# Altium schematic sheet MCU.SchDoc
size Legal; Author: Mark & Qiming; DocumentNumber: 3; SheetNumber: 3; SheetTotal: 9
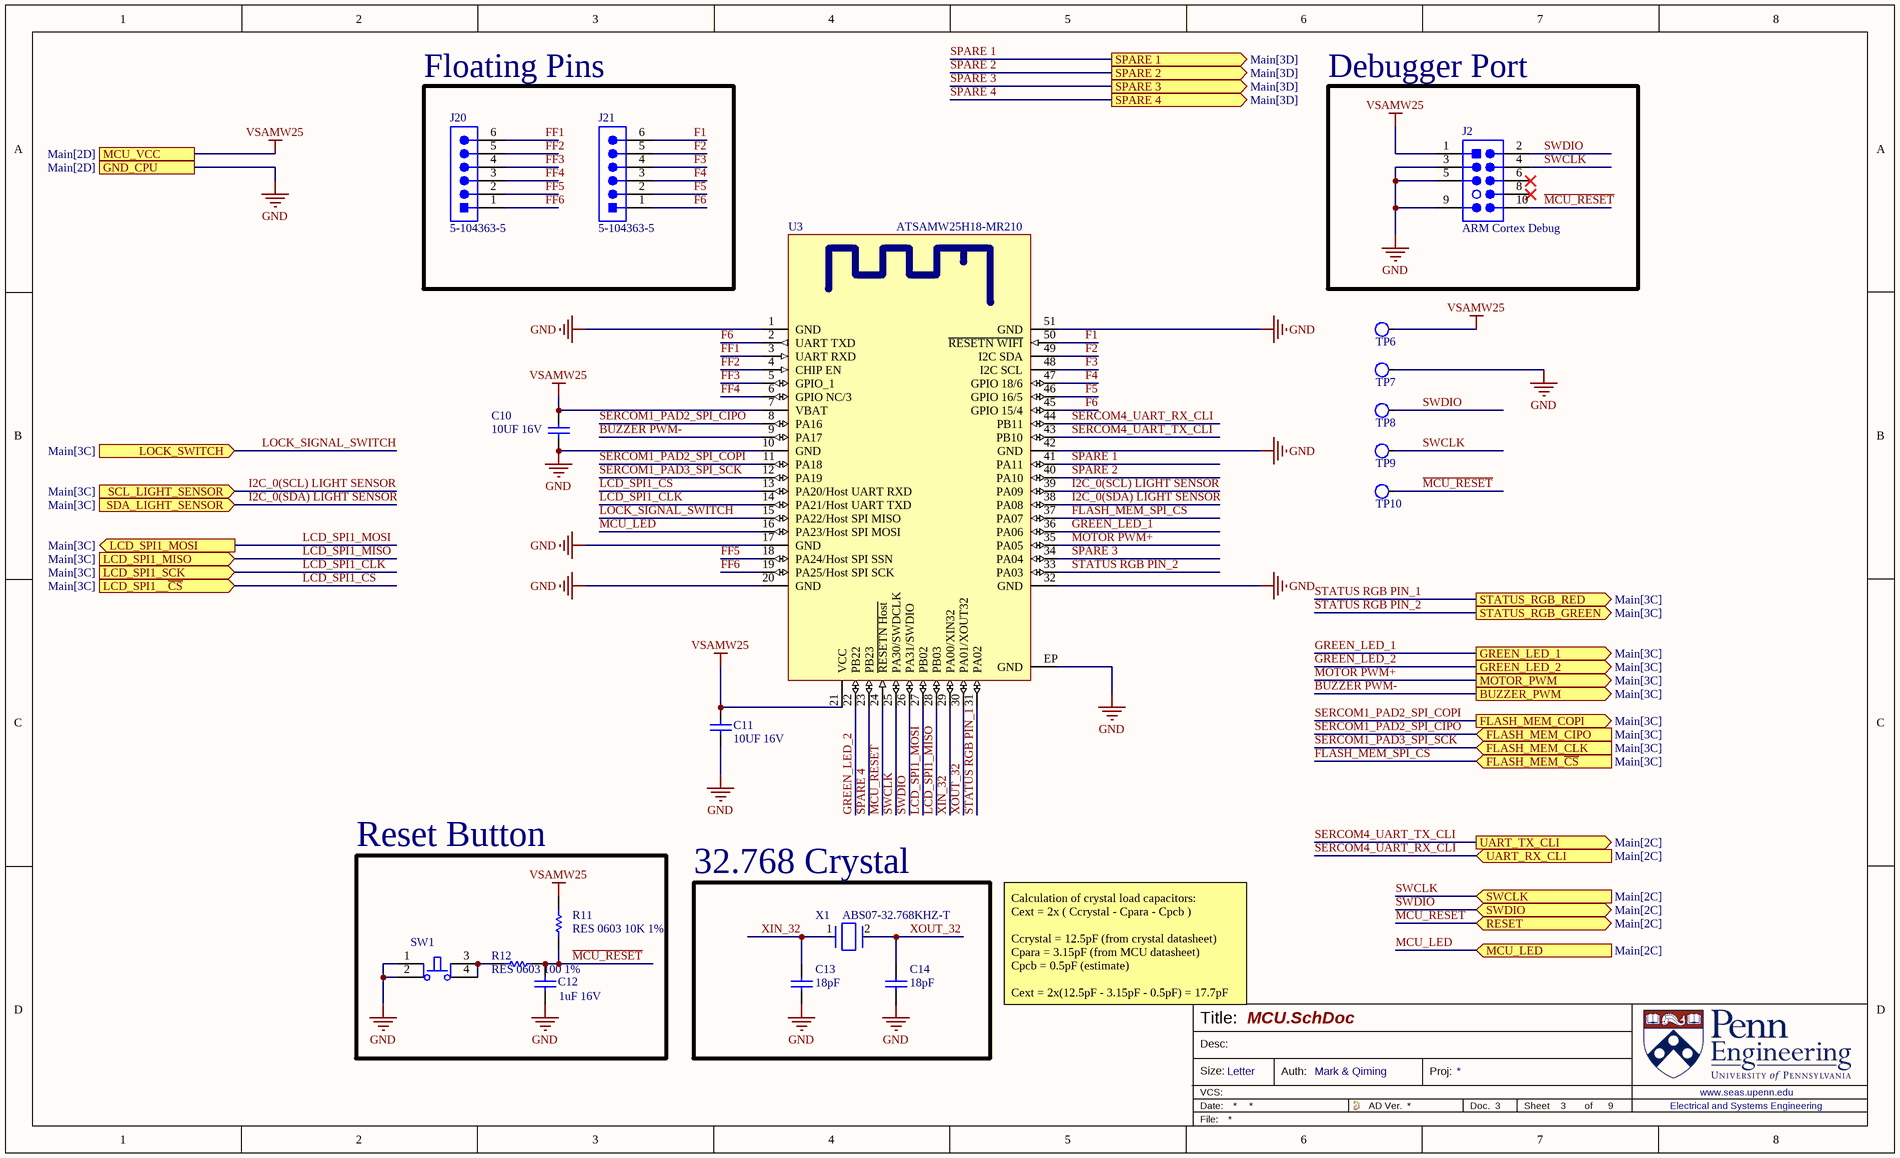
[diagram p0: MCU.SchDoc]

## Parts
C10  10UF 16V  [0805_CAP_60H]
C11  10UF 16V  [0805_CAP_60H]
C12  1uF 16V  [0603_CAP]
C13  18pF  [0603_CAP]
C14  18pF  [0603_CAP]
J2  ARM Cortex Debug  [FTSH-105-01-F-DV-007-K PLUGIN]
J20  5-104363-5  [5-104363-5-Footprint-1]
J21  5-104363-5  [5-104363-5-Footprint-1]
R11  RES 0603 10K 1%  [0603_RES]
R12  RES 0603 100 1%  [0603_RES]
SW1  PTS810SJK250SMTRLFS  [PTS810SJK250SMTRLFS-Footprint-1]  (value not drawn)
TP6  Testpad  [SMT Testpoint, 50mil]  (value not drawn)  (no BOM)
TP7  Testpad  [SMT Testpoint, 50mil]  (value not drawn)  (no BOM)
TP8  Testpad  [SMT Testpoint, 50mil]  (value not drawn)  (no BOM)
TP9  Testpad  [SMT Testpoint, 50mil]  (value not drawn)  (no BOM)
TP10  Testpad  [SMT Testpoint, 50mil]  (value not drawn)  (no BOM)
U3  ATSAMW25H18-MR210  [ATSAMW25H18-MR210-Footprint-1]
X1  ABS07-32.768KHZ-T  [FP-ABS07-MFG]

## Blocks framed on the sheet
Floating Pins: J20 J21
Debugger Port: J2
Reset Button: C12 R11 R12 SW1
32.768 Crystal: C13 C14 X1

## Ports
BUZZER_PWM (out, see Main[3C]), FLASH_MEM_CIPO (in, see Main[3C]), FLASH_MEM_CLK (in, see Main[3C]), FLASH_MEM_COPI (out, see Main[3C]), FLASH_MEM_~{CS} (in, see Main[3C]), GND_CPU (see Main[2D]), GREEN_LED_1 (out, see Main[3C]), GREEN_LED_2 (out, see Main[3C]), LCD_SPI1__~{CS} (in, see Main[3C]), LCD_SPI1_MISO (in, see Main[3C]), LCD_SPI1_MOSI (out, see Main[3C]), LCD_SPI1_SCK (in, see Main[3C]), LOCK_SWITCH (in, see Main[3C]), MCU_LED (in, see Main[2C]), MCU_VCC (see Main[2D]), MOTOR_PWM (out, see Main[3C]), RESET (bidir, see Main[2C]), SCL_LIGHT_SENSOR (in, see Main[3C]), SDA_LIGHT_SENSOR (in, see Main[3C]), SPARE 1 (out, see Main[3D]), SPARE 2 (out, see Main[3D]), SPARE 3 (out, see Main[3D]), SPARE 4 (out, see Main[3D]), STATUS_RGB_GREEN (out, see Main[3C]), STATUS_RGB_RED (out, see Main[3C]), SWCLK (in, see Main[2C]), SWDIO (bidir, see Main[2C]), UART_RX_CLI (in, see Main[2C]), UART_TX_CLI (out, see Main[2C])

## Nets
GND: C10.1 C11.2 C12.1 C13.1 C14.1 J2.3 J2.5 J2.9 SW1.1 SW1.2 TP7.1 U3.1(GND) U3.10(GND) U3.17(GND) U3.20(GND) U3.32(GND) U3.42(GND) U3.51(GND) U3.EP(GND) ; port GND_CPU
VSAMW25: C10.2 C11.1 J2.1 R11.2 TP6.1 U3.7(VBAT) U3.21(VCC) ; port MCU_VCC
BUZZER PWM-: U3.9(PA17) ; port BUZZER_PWM
F1: J21.6 U3.50(~{RESETN_WIFI})
F2: J21.5 U3.49(I2C_SDA)
F3: J21.4 U3.48(I2C_SCL)
F4: J21.3 U3.47(GPIO_18/6)
F5: J21.2 U3.46(GPIO_16/5)
F6: J21.1 U3.2(UART_TXD) U3.45(GPIO_15/4)
FF1: J20.6 U3.3(UART_RXD)
FF2: J20.5 U3.4(CHIP_EN)
FF3: J20.4 U3.5(GPIO_1)
FF4: J20.3 U3.6(GPIO_NC/3)
FF5: J20.2 U3.18(PA24/Host_SPI_SSN)
FF6: J20.1 U3.19(PA25/Host_SPI_SCK)
FLASH_MEM_SPI_~{CS}: U3.37(PA07) ; port FLASH_MEM_~{CS}
GREEN_LED_1: U3.36(PA06) ; port GREEN_LED_1
GREEN_LED_2: U3.22(PB22) ; port GREEN_LED_2
I2C_0(SCL) LIGHT SENSOR: U3.39(PA09) ; port SCL_LIGHT_SENSOR
I2C_0(SDA) LIGHT SENSOR: U3.38(PA08) ; port SDA_LIGHT_SENSOR
LCD_SPI1_~{CS}: U3.13(PA20/Host_UART_RXD) ; port LCD_SPI1__~{CS}
LCD_SPI1_CLK: U3.14(PA21/Host_UART_TXD) ; port LCD_SPI1_SCK
LCD_SPI1_MISO: U3.28(PB03) ; port LCD_SPI1_MISO
LCD_SPI1_MOSI: U3.27(PB02) ; port LCD_SPI1_MOSI
LOCK_SIGNAL_SWITCH: U3.15(PA22/Host_SPI_MISO) ; port LOCK_SWITCH
~{MCU_RESET}: C12.2 J2.10 R11.1 R12.2 TP10.1 U3.24(~{RESETN_Host})
MCU_LED: U3.16(PA23/Host_SPI_MOSI) ; port MCU_LED
MCU_RESET: port RESET
MOTOR PWM+: U3.35(PA05) ; port MOTOR_PWM
SERCOM1_PAD2_SPI_CIPO: U3.8(PA16) ; port FLASH_MEM_CIPO
SERCOM1_PAD2_SPI_COPI: U3.11(PA18) ; port FLASH_MEM_COPI
SERCOM1_PAD3_SPI_SCK: U3.12(PA19) ; port FLASH_MEM_CLK
SERCOM4_UART_RX_CLI: U3.44(PB11) ; port UART_RX_CLI
SERCOM4_UART_TX_CLI: U3.43(PB10) ; port UART_TX_CLI
SPARE 1: U3.41(PA11) ; port SPARE 1
SPARE 2: U3.40(PA10) ; port SPARE 2
SPARE 3: U3.34(PA04) ; port SPARE 3
SPARE 4: U3.23(PB23) ; port SPARE 4
STATUS RGB PIN_1: U3.31(PA02) ; port STATUS_RGB_RED
STATUS RGB PIN_2: U3.33(PA03) ; port STATUS_RGB_GREEN
SWCLK: J2.4 TP9.1 U3.25(PA30/SWDCLK) ; port SWCLK
SWDIO: J2.2 TP8.1 U3.26(PA31/SWDIO) ; port SWDIO
XIN_32: C13.2 U3.29(PA00/XIN32) X1.1
XOUT_32: C14.2 U3.30(PA01/XOUT32) X1.2
NetR12_1: R12.1 SW1.3 SW1.4

Not connected (* = marked no-connect by the designer): J2 6* 8*

## Notes on the sheet
- Calculation of crystal load capacitors:
  Cext = 2x ( Ccrystal - Cpara - Cpcb )
  Ccrystal = 12.5pF (from crystal datasheet)
  Cpara = 3.15pF (from MCU datasheet)
  Cpcb = 0.5pF (estimate)
  Cext = 2x(12.5pF - 3.15pF - 0.5pF) = 17.7pF
- Title:
- Desc:
- Size:
- Letter
- Auth:
- Proj:
- Sheet
- of
- www.seas.upenn.edu
- Electrical and Systems Engineering

## Library data of the parts
C10 C11 = CMP-011-000479-1: Capacitor Surface Mount 0805 Footprint 10UF 16V 20% Tolerance Ceramic X7R; Manufacturer: Various; Manufacturer P/N: CAP 0805 10UF 16V 20% X7R; PCB Package: 0805; Description in Visual: Cap SMT 0805 10UF 16V 20% Ceramic X7R; Tolerance: 20%; Type: Ceramic X7R; Mount: SMT; P/N: CAP 0805 10UF 16V 20% X7R; Voltage: 16V; Value: 10UF
C12 = CMP-011-000286-1: Capacitor Surface Mount 0603 Footprint 1UF 16V 10% Tolerance Ceramic X7R; Manufacturer: Various; P/N: CAP 0603 1UF 16V 10% X7R; PCB Package: 0603; Description in Visual: Cap SMT 0603 1UF 16V 10% Ceramic X7R; Manufacturer P/N: CAP 0603 1UF 16V 10% X7R; Tolerance: 10%; Type: Ceramic X7R; Value: 1UF; Mount: SMT; Voltage: 16V
C13 C14 = CMP-011-000283-1: Capacitor Surface Mount 0603 Footprint 18PF 50V 5% Tolerance Ceramic C0G; Manufacturer: Various; Manufacturer P/N: CAP 0603 18PF 50V 5% C0G; Description in Visual: Cap SMT 0603 18PF 50V 5%  Cer C0G; PCB Package: 0603; Voltage: 50V; Type: Ceramic C0G; Tolerance: 5%; Value: 18PF; P/N: CAP 0603 18PF 50V 5% C0G; Mount: SMT
J2 = CMP-002-000013-1: 10 Pin Shrouded Header, 0.050", Key Pin 7; Manufacturer P/N: Various; Manufacturer: Samtech; Gender: Male; Number of Contacts: 10; ComponentLink1URL: http://infocenter.arm.com/help/topic/com.arm.doc.faqs/attached/13634/cortex_debug_connectors.pdf; Description in Visual: 10 Pin Shrouded Header, 0.050", Key Pin 7; P/N: ARM Cortex Debug; Number of Rows: 2; Contact Finish: Gold; ComponentLink1Description: Pinout Reference; ComponentLink2URL: http://suddendocs.samtec.com/catalog_english/ftsh_smt.pdf; Pitch: 0.050"; Orientation: Vertical; ComponentLink2Description: Datasheet for Connector
J20 J21 = CMP-00108-1: Board Connector, 6 Contact(s), 1 Row(s), Male, Straight, 0.1 inch Pitch, Solder Terminal, Locking, Black Insulator, Plug
R11 = CMP-005-002156-3: Resistor Surface Mount, 10K Ohms, 0603 Footprint, 1% Tolerance 0.1W; Manufacturer: Various; PCB Package: 0603; Description in Visual: Res SMT 10K 0603  1%  0.1W; Manufacturer P/N: RES 0603 10K 1%; Tolerance: 1%; Mount: SMT; Value: 10k; JLCPCB Part #: C25804; Power Rating: 0.1W
R12 = CMP-005-002125-2: Resistor Surface Mount, 100 Ohms, 0603 Footprint, 1% Tolerance 0.1W; Manufacturer: Various; Manufacturer P/N: RES 0603 100R 1%; Value: 100; Description in Visual: Res SMT 100 0603  1%  0.1W; PCB Package: 0603; Mount: SMT; Tolerance: 1%; Power Rating: 0.1W
SW1 = CMP-00084-3: Keypad Switch, 1 Switches, SPST, Momentary tactile button, 0.05A, 16VDC, 3.23N, Solder Terminal, Surface Mount-straight; Manufacturer Series: PTS810; Actuator Length: 0.028inch; Electrical Life: 50000Cycles; Contact Resistance: 0.5mR; Solderability: REFLOW; Actuator Travel: 0.1524mm; Actuator Color: White; Actuator Type: Pushbutton; Insulation Resistance: 100MR; Dielectric Withstand Volts: 250VACV; Switch Function: OFF-MOM; Reach SVHC Compliant: Yes; Terminal Finish: Silver; Switch Type: Keypad; Switch Action: MOMENTARY; RoHS Compliant: Yes; JESD-609 Code: e4; Max Operating Temperature: 85°C; Termination: Solder; Min Operating Temperature: -40°C; Mounting Technology: Surface Mount; Circuit: SPST; Type: Tactile
TP6-TP10 = CMP-00049-4: Test Pad/Point (Testpoint, Testpad), for probing
U3 = CMP-00071-2: WiFi 802.11b/g/n Transceiver Module 2.412GHz ~ 2.484GHz Integrated, Trace Surface Mount, Integrated SAMD21 Cortex M0+
X1 = CMP-0447-00001-4: Crystal 32.768kHz ±20ppm (Tol) 12.5pF FUND 70kΩ 2-Pin CSMD T/R; ESR (Equivalent Series Resistance): 70kR; Frequency: 32.768kHz; Radiation Hardening: No; Length: 3.2mm; Max Operating Temperature: 85°C; Number of Pins: 2; Series: ABS07; Min Operating Temperature: -40°C; Frequency Tolerance: 20ppm; Packaging: Tape and Reel; Height: 0.9mm; Width: 1.5mm; Depth: 1.5mm; Load Capacitance: 12.5pF; RoHS Compliant: Yes; Tolerance: 20ppm; Termination: SMD/SMT; Lead Free: Lead Free; Series Resistance: 70kR; REACH SVHC: No SVHC; Case/Package: CSMD; Operating Frequency: 32.768 kHz; Package Quantity: 3000